# EasyEDA Pro project 交直流分离电路.eprj

# Schematic Schematic1
Board Name: Board1; Create Date: 2025-07-15; Page Name: P1; Project Name: 交直流分离电路; Schematic Name: Schematic1; Update Date: 2025-07-16; Page Size: A4; Version: V1.0
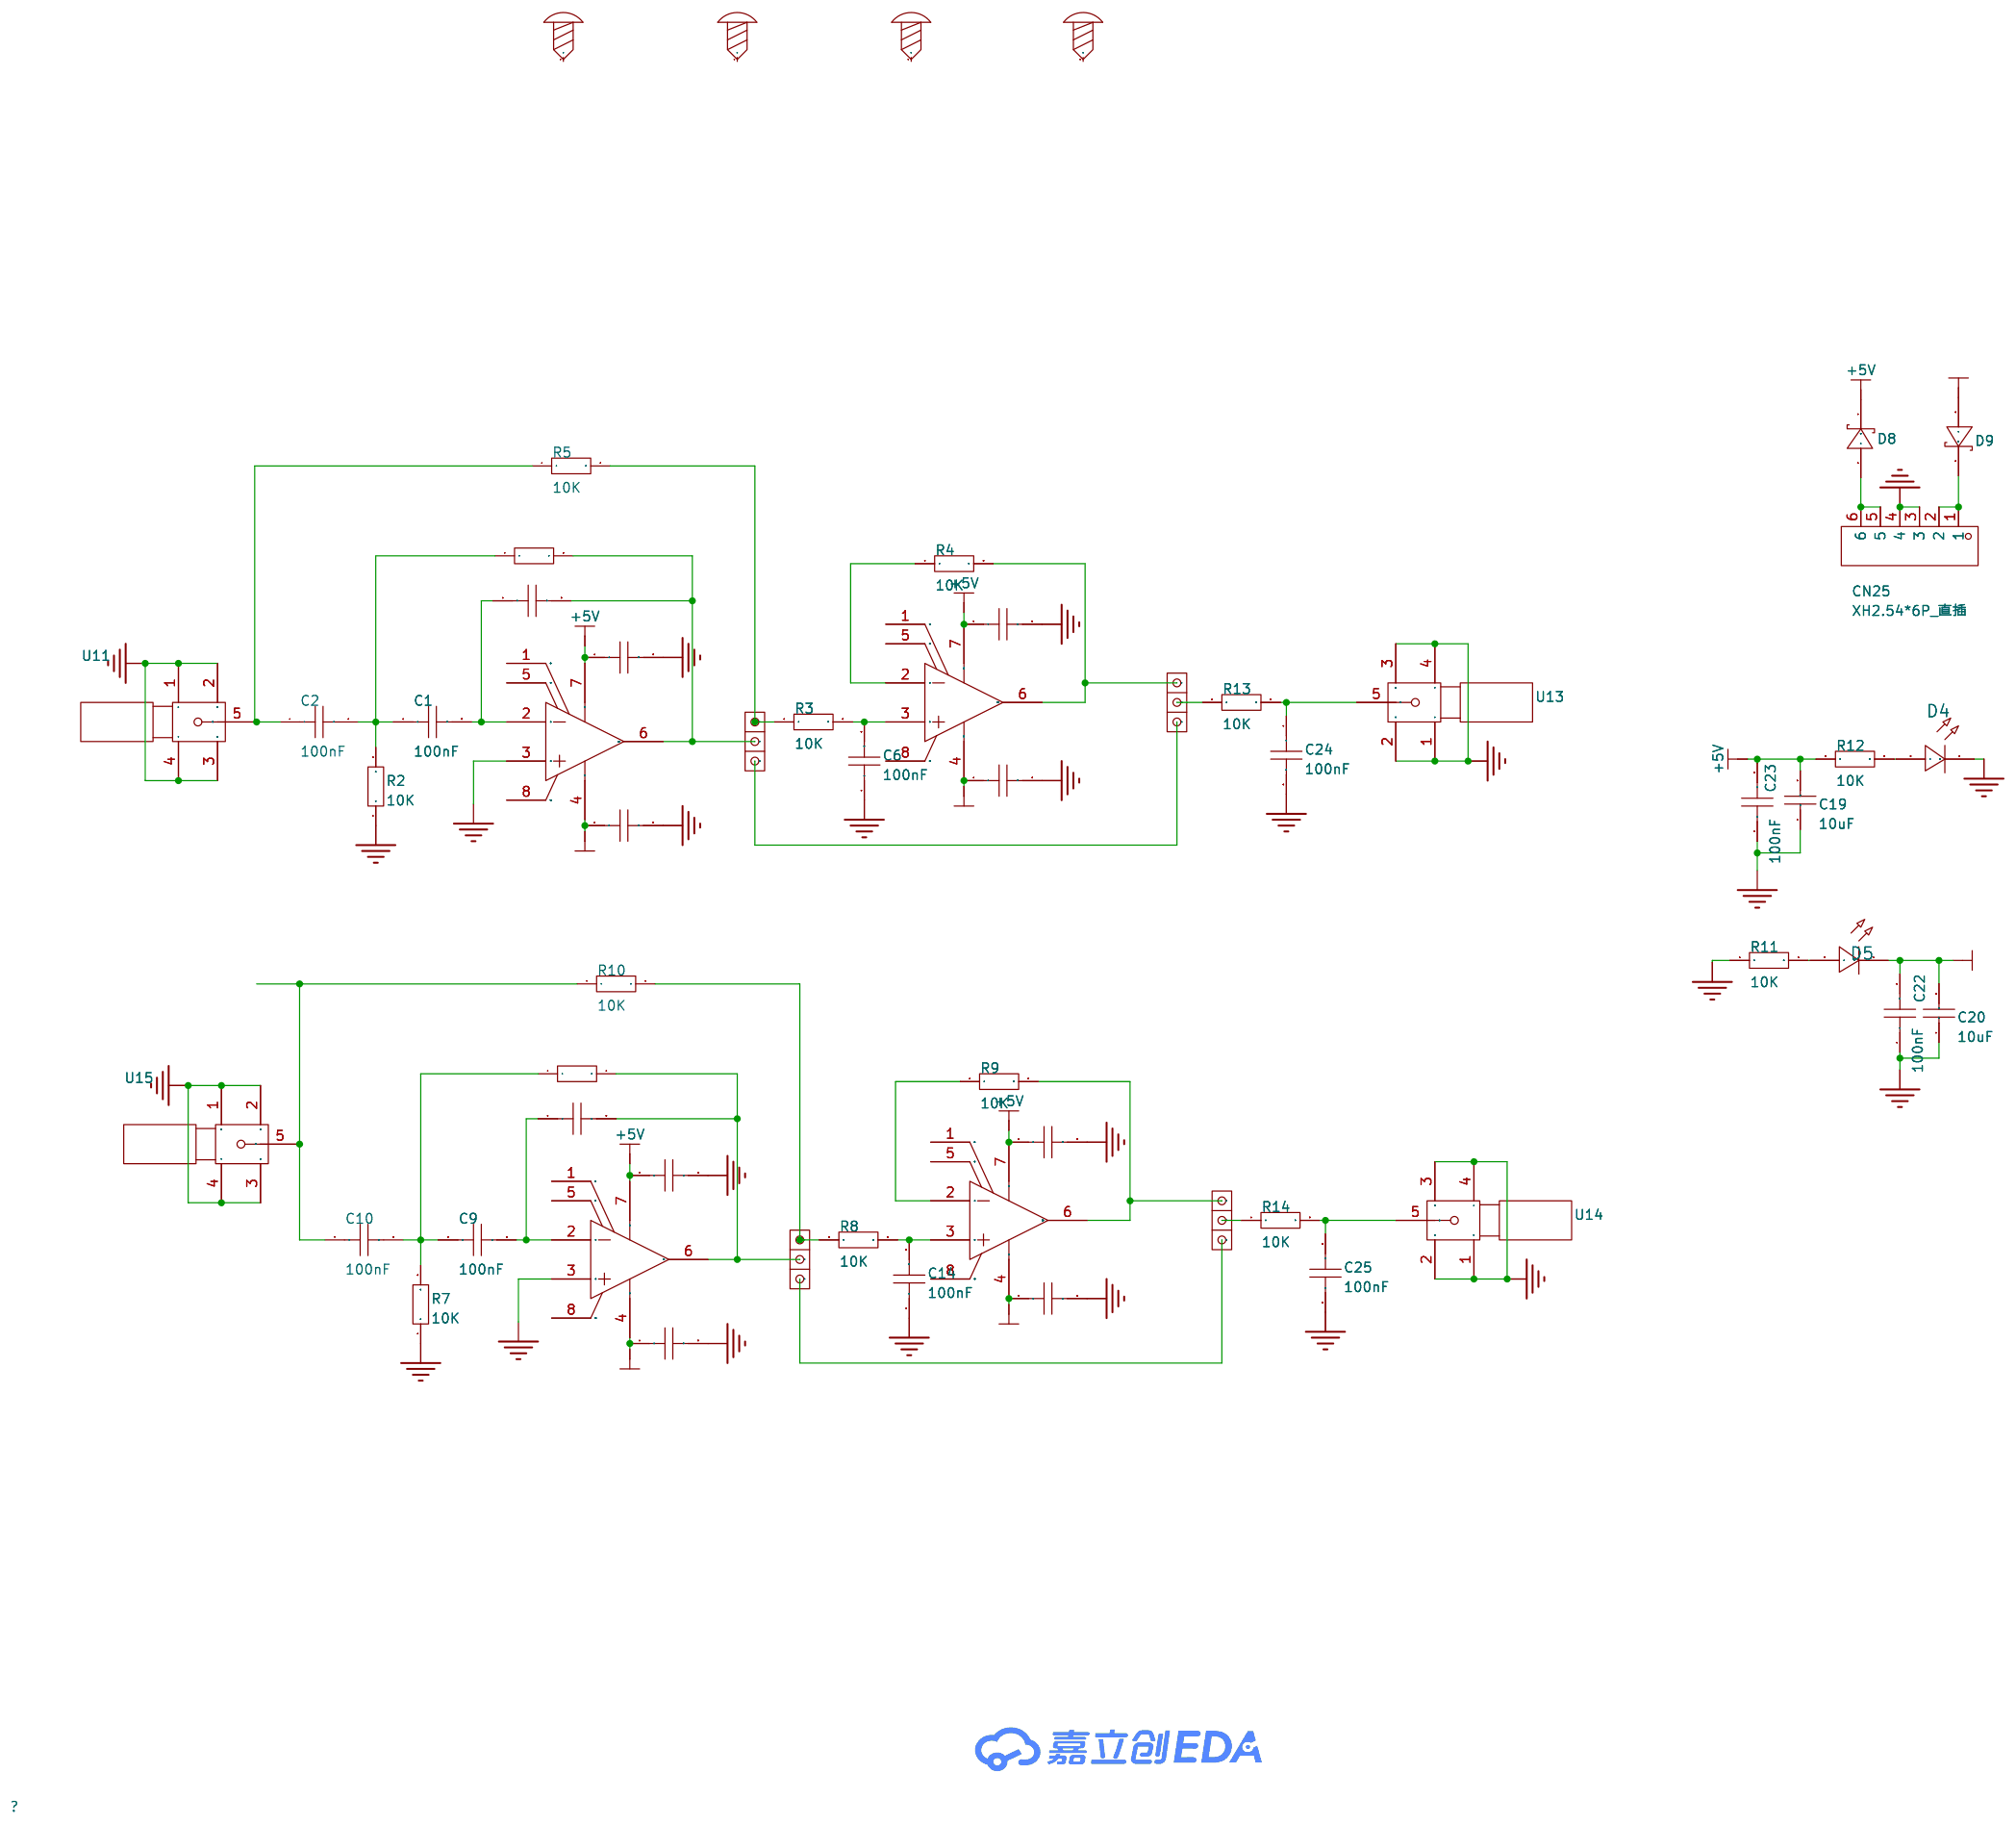
[diagram p0: schematic sheet]

## Parts
C1  100nF  [R0805]
C2  100nF  [R0805]
C3  100nF  [R0805]
C4  100nF  [R0805]
C5  100nF  [R0805]
C6  100nF  [R0805]
C7  100nF  [R0805]
C8  100nF  [R0805]
C9  100nF  [R0805]
C10  100nF  [R0805]
C11  100nF  [R0805]
C12  100nF  [R0805]
C13  100nF  [R0805]
C14  100nF  [R0805]
C15  100nF  [R0805]
C16  100nF  [R0805]
C19  10uF  [C1210]
C20  10uF  [C1210]
C22  100nF  [R0805]
C23  100nF  [R0805]
C24  100nF  [R0805]
C25  100nF  [R0805]
CN25  XH2.54*6P_直插  [CONN-TH_XH2.54-6P]
D4  -  [LED_0805]
D5  -  [LED_0805]
D8  SD103AWS  [SOD-323_L1.8-W1.3-LS2.5-RD]
D9  SD103AWS  [SOD-323_L1.8-W1.3-LS2.5-RD]
R1  10K  [R0805]
R2  10K  [R0805]
R3  10K  [R0805]
R4  10K  [R0805]
R5  10K  [R0805]
R6  10K  [R0805]
R7  10K  [R0805]
R8  10K  [R0805]
R9  10K  [R0805]
R10  10K  [R0805]
R11  10K  [R0805]
R12  10K  [R0805]
R13  10K  [R0805]
R14  10K  [R0805]
SCREW1  -  [M3螺丝]
SCREW2  -  [M3螺丝]
SCREW3  -  [M3螺丝]
SCREW4  -  [M3螺丝]
U1  OPA695IDR  [SOIC-8_L5.0-W4.0-P1.27-LS6.1-BL]
U2  -  [1*3跳线]
U3  OPA695IDR  [SOIC-8_L5.0-W4.0-P1.27-LS6.1-BL]
U4  -  [1*3跳线]
U5  OPA695IDR  [SOIC-8_L5.0-W4.0-P1.27-LS6.1-BL]
U6  -  [1*3跳线]
U7  OPA695IDR  [SOIC-8_L5.0-W4.0-P1.27-LS6.1-BL]
U8  -  [1*3跳线]
U11  -  [SMA]
U13  -  [SMA]
U14  -  [SMA]
U15  -  [SMA]

## Library data of the parts
C1-C16 C22-C25 = CAP_0805: Supplier Footprint: 0805
C19 C20 = CL32B106KAJNNNE: 容值:10uF;精度:±10%;额定电压:25V;材质(温度系数):X7R;; LCSC Part Name: 10uF ±10% 25V; Supplier Part: C39232; Manufacturer: SAMSUNG(三星); Supplier Footprint: 1210; JLCPCB Part Class: 扩展库; Datasheet: https://atta.szlcsc.com/upload/public/pdf/source/20160218/1457707763339.pdf; Supplier: LCSC; Tolerance: ±10%; Voltage Rated: 25V; Temperature Coefficient: X7R
CN25 = XH2.54*6P_直插: Supplier Part: C9900008614; Supplier Footprint: XH2.54_6P; JLCPCB Part Class: 扩展库; Supplier: LCSC
D4 D5 = LED_0805-R: Supplier Footprint: 0805
D8 D9 = SD103AWS_C181207: 正向压降(Vf):600mV@200mA;直流反向耐压(Vr):40V;整流电流:350mA;; LCSC Part Name: 电压:40V 电流:350mA 丝印S4; Supplier Part: C181207; Manufacturer: Hottech(合科泰); Supplier Footprint: SOD-323; JLCPCB Part Class: 扩展库; Datasheet: https://atta.szlcsc.com/upload/public/pdf/source/20240513/4691873FBB9173EFBCF4C6FD4BBA1025.pdf; Supplier: LCSC; Forward Voltage (Vf@If): 600mV@200mA; Reverse Voltage (Vr): 40V; Rectified Current: 350mA
R1-R14 = Res_0805: Supplier Footprint: 0805
SCREW1-SCREW4 = M3螺丝: Supplier Footprint: 插件
U1 U3 U5 U7 = OPA695IDR: Supplier Part: C1848175; Manufacturer: TI(德州仪器); Supplier Footprint: SOIC-8; JLCPCB Part Class: 扩展库; Datasheet: https://www.ti.com/cn/lit/gpn/opa695; Supplier: LCSC; Number of Channels: 单路; Slew Rate: 4.3V/ns; Ib - Input Bias Current: 20uA; Output Current: 120mA; Operating Temperature: -40℃~+85℃
U2 U4 U6 U8 = 1*3跳线
U11 U13-U15 = SMA

## Nets
+5V: C4.1 C7.1 C12.1 C15.1 C19.2 C23.2 D8.1(C) R12.1 U1.7(+VS) U3.7(+VS) U5.7(+VS) U7.7(+VS)
-5V: C5.1 C8.1 C13.1 C16.1 C20.2 C22.2 D5.1(C) D9.2(A) U1.4(-VS) U3.4(-VS) U5.4(-VS) U7.4(-VS)
GND: C4.2 C5.2 C6.1 C7.2 C8.2 C12.2 C13.2 C14.1 C15.2 C16.2 C19.1 C20.1 C22.1 C23.1 C24.2 C25.2 CN25.3 CN25.4 D4.1(C) R2.1 R7.1 R11.1 U1.3(+IN) U5.3(+IN) U11.1 U11.2 U11.3 U11.4 U13.1 U13.2 U13.3 U13.4 U14.1 U14.2 U14.3 U14.4 U15.1 U15.2 U15.3 U15.4
$1N341: C1.2 C3.1 U1.2(-IN)
$1N345: C1.1 C2.2 R1.1 R2.2
$1N358: C3.2 R1.2 U1.6(Output) U2.2
$1N838: R3.1 R5.2 U2.1
$1N842: C6.2 R3.2 U3.3(+IN)
$1N870: R4.1 U3.2(-IN)
$1N879: R4.2 U3.6(Output) U4.1
$1N1220: U2.3 U4.3
$1N1853: C9.1 C10.2 R6.1 R7.2
$1N1859: C9.2 C11.1 U5.2(-IN)
$1N1873: C14.2 R8.2 U7.3(+IN)
$1N1876: R8.1 R10.2 U6.1
$1N1882: R9.1 U7.2(-IN)
$1N1888: C11.2 R6.2 U5.6(Output) U6.2
$1N1897: U6.3 U8.3
$1N1908: R9.2 U7.6(Output) U8.1
$1N2072: CN25.5 CN25.6 D8.2(A)
$1N2074: CN25.1 CN25.2 D9.1(C)
$1N2372: D5.2(A) R11.2
$1N2374: D4.2(A) R12.2
$1N2575: R13.1 U4.2
$1N2579: C24.1 R13.2 U13.5
$1N2780: C25.1 R14.2 U14.5
$1N2788: R14.1 U8.2
$1N3941: C10.1 R10.1 U15.5
$1N3947: C2.1 R5.1 U11.5

Not connected (* = marked no-connect by the designer): SCREW1 1; SCREW2 1; SCREW3 1; SCREW4 1; U1 1(NC) 5(NC) 8(DIS#); U3 1(NC) 5(NC) 8(DIS#); U5 1(NC) 5(NC) 8(DIS#); U7 1(NC) 5(NC) 8(DIS#)

# Board PCB1
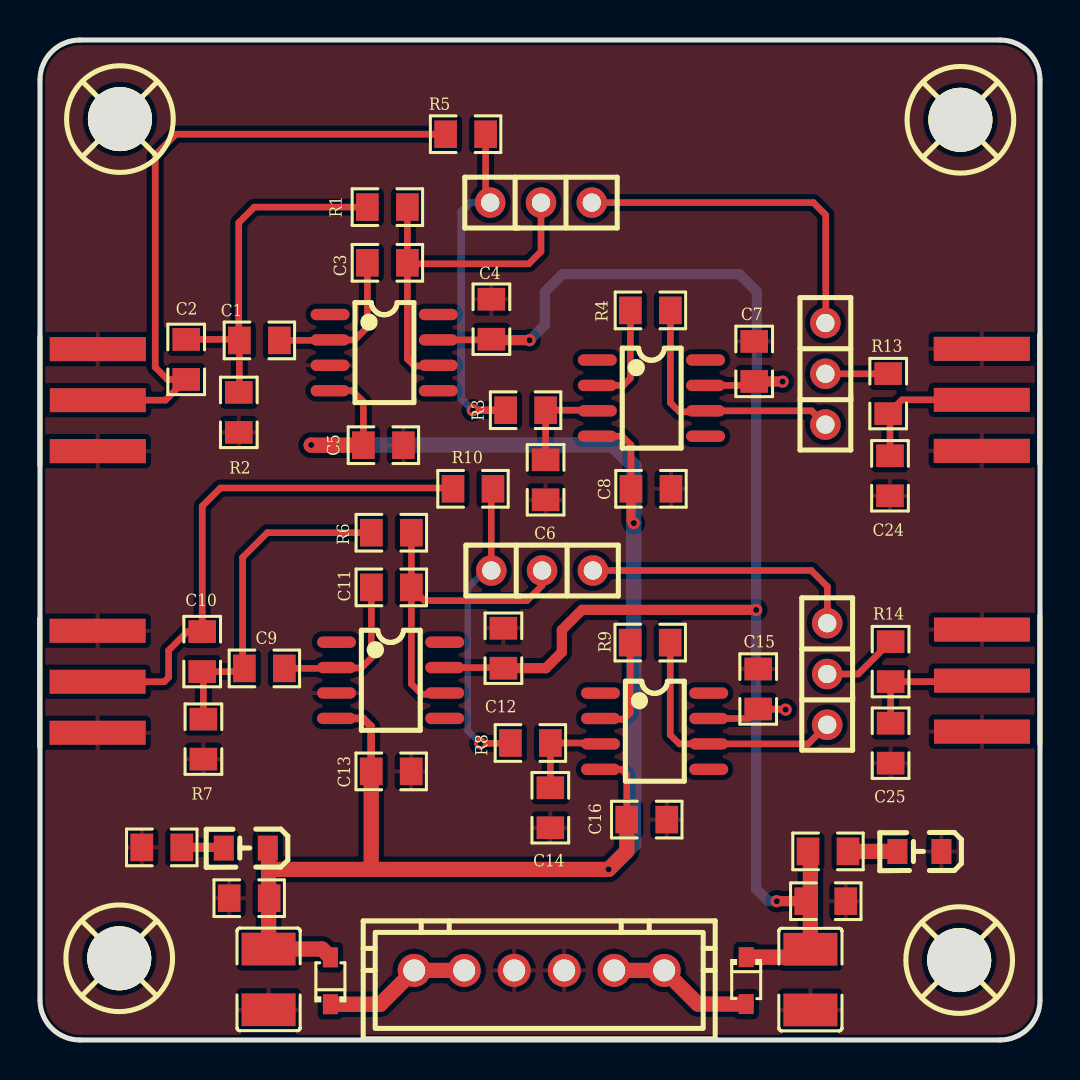
[diagram p1: board, top side]
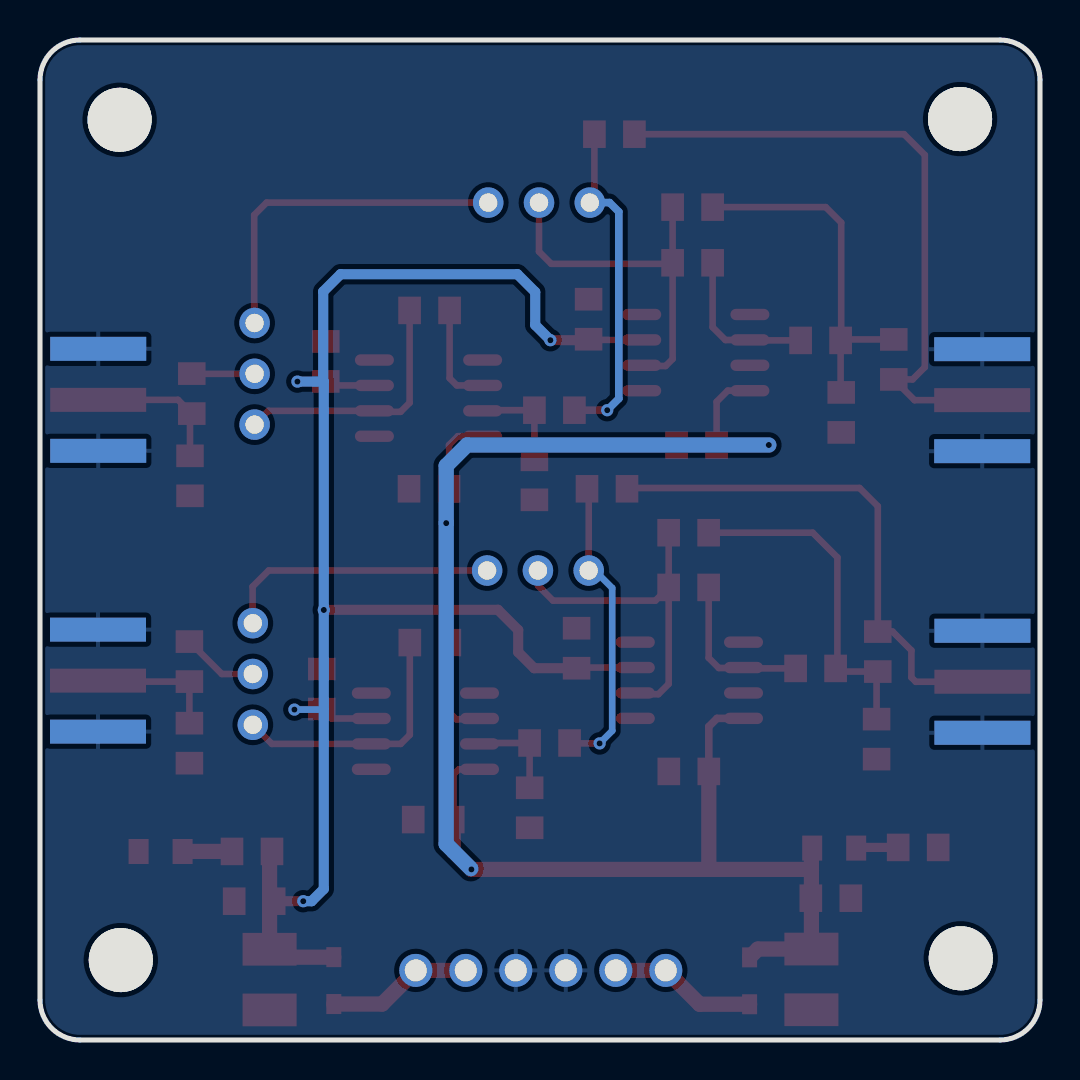
[diagram p2: board, bottom side, seen from below]

Outline 50 x 50 mm; copper layers: Top Layer, Bottom Layer. Coordinates in mm from the lower left corner of the outline.
Outline path: 0,48 0,2 arc(0.59,0.59) 2,0 48,0 arc(49.41,0.59) 50,2 50,48 arc(49.41,49.41) 48,50 2,50 arc(0.59,49.41) 0,48
Stack: Top Layer 0.035mm / Dielectric1 1.51mm FR4 er 4.5 / Bottom Layer 0.035mm

## Design rules (mm)
template: 自定义配置
spacing copperThickness1oz (default): track to track 0.102, other pairs 0.152 to 0.3
spacing copperThickness2oz: track to track 0.203, other pairs 0.152 to 0.3
track width copperThickness1oz (default): min 0.127, default 0.33, max 2.54
track width copperThickness2oz: min 0.203, default 0.254, max 2.54
differential pair differentialPair (default): width min 0.127, default 0.254, max 2.54; gap min 0.152, default 0.152
via viaSize (default): diameter min 0.5, default 0.61, max 10; hole min 0.3, default 0.305, max 6.3

## Placement (name value [footprint] x y rotation side)
C1  100nF  [R0805]  11.08 34.98 0 top
C2  100nF  [R0805]  7.31 34.14 90 top
C3  100nF  [R0805]  17.48 38.86 0 top
C4  100nF  [R0805]  22.57 36.15 90 top
C5  100nF  [R0805]  17.28 29.74 0 top
C6  100nF  [R0805]  25.28 28.12 90 top
C7  100nF  [R0805]  35.71 34.04 90 top
C8  100nF  [R0805]  30.66 27.56 0 top
C9  100nF  [R0805]  11.33 18.58 0 top
C10  100nF  [R0805]  8.11 19.31 270 top
C11  100nF  [R0805]  17.68 22.63 0 top
C12  100nF  [R0805]  23.17 19.7 90 top
C13  100nF  [R0805]  17.67 13.43 0 top
C14  100nF  [R0805]  25.52 11.72 90 top
C15  100nF  [R0805]  35.91 17.66 90 top
C16  100nF  [R0805]  30.45 11.02 0 top
C19  10uF  [C1210]  38.52 3.02 90 top
C20  10uF  [C1210]  11.43 3.03 90 top
C22  100nF  [R0805]  10.57 7.09 0 top
C23  100nF  [R0805]  39.18 6.94 180 top
C24  100nF  [R0805]  42.5 28.1 270 top
C25  100nF  [R0805]  42.53 14.73 270 top
CN25  XH2.54*6P_直插  [CONN-TH_XH2.54-6P]  24.96 3.48 0 top
D4  -  [LED_0805]  43.92 9.43 180 top
D5  -  [LED_0805]  10.24 9.6 180 top
D8  SD103AWS  [SOD-323_L1.8-W1.3-LS2.5-RD]  35.31 2.97 270 top
D9  SD103AWS  [SOD-323_L1.8-W1.3-LS2.5-RD]  14.52 2.96 90 top
R1  10K  [R0805#2]  17.37 41.64 0 top
R2  10K  [R0805#2]  9.94 31.38 90 top
R3  10K  [R0805#2]  24.28 31.49 0 top
R4  10K  [R0805#2]  30.52 36.48 0 top
R5  10K  [R0805#2]  21.28 45.29 0 top
R6  10K  [R0805#2]  17.57 25.36 0 top
R7  10K  [R0805#2]  8.17 15.04 90 top
R8  10K  [R0805#2]  24.52 14.85 0 top
R9  10K  [R0805#2]  30.51 19.87 0 top
R10  10K  [R0805#2]  21.65 27.56 0 top
R11  10K  [R0805#2]  6.09 9.63 0 top
R12  10K  [R0805#2]  39.4 9.43 0 top
R13  10K  [R0805#2]  42.41 32.32 270 top
R14  10K  [R0805#2]  42.53 18.92 270 top
SCREW1  -  [M3螺丝]  4 46.05 0 top
SCREW2  -  [M3螺丝]  46.02 46.01 0 top
SCREW3  -  [M3螺丝]  3.96 4.09 0 top
SCREW4  -  [M3螺丝]  45.96 4 0 top
U1  OPA695IDR  [SOIC-8_L5.0-W4.0-P1.27-LS6.1-BL]  17.21 34.37 270 top
U2  -  [1*3跳线]  27.59 41.87 90 top
U3  OPA695IDR  [SOIC-8_L5.0-W4.0-P1.27-LS6.1-BL]  30.57 32.09 270 top
U4  -  [1*3跳线]  39.27 35.85 180 top
U5  OPA695IDR  [SOIC-8_L5.0-W4.0-P1.27-LS6.1-BL]  17.53 17.99 270 top
U6  -  [1*3跳线]  27.64 23.47 90 top
U7  OPA695IDR  [SOIC-8_L5.0-W4.0-P1.27-LS6.1-BL]  30.73 15.44 270 top
U8  -  [1*3跳线]  39.36 20.84 180 top
U11  -  [SMA]  -0.92 26.13 0 top
U13  -  [SMA]  50.9 37.87 180 top
U14  -  [SMA]  50.91 23.83 180 top
U15  -  [SMA]  -0.93 12.05 0 top

## Footprints (pads in the part's own frame, mm; a bottom-side part is the same pattern mirrored in y, then rotated)
1*3跳线
  round 1.524 hole 0.914: 1(0,5.08) 2(0,2.54) 3(0,0)
C1210
  rect 1.635x2.7 smd: 1(-1.518,0) 2(1.518,0)
CONN-TH_XH2.54-6P
  round 1.65 hole 1.1: 1(-6.25,0) 2(-3.75,0) 3(-1.25,0) 4(1.25,0) 5(3.75,0) 6(6.25,0)
LED_0805
  rect 1x1.25 smd: 1(-1.15,0.005) 2(1.05,0.005)
M3螺丝
  round 3.2 hole 3.2: 1(0,0)
R0805
  rect 1.133x1.377 smd: 1(-1.111,0) 2(0.889,0)
R0805#2
  rect 1.133x1.377 smd: 1(-1,0) 2(1,0)
SMA
  rect 4.8x1.2 smd: 1(3.81,8.412) 2(3.81,3.312) 5(3.81,5.862)
  rect 4.8x1.2 smd far side: 3(3.81,3.312) 4(3.81,8.412)
SOD-323_L1.8-W1.3-LS2.5-RD
  rect 1x0.75 smd: 1(-1.173,0) 2(1.173,0)
SOIC-8_L5.0-W4.0-P1.27-LS6.1-BL
  oval 0.569x1.95 smd: 1(-1.905,-2.705) 2(-0.635,-2.705) 3(0.635,-2.705) 4(1.905,-2.705) 5(1.905,2.705) 6(0.635,2.705) 7(-0.635,2.705) 8(-1.905,2.705)

## Nets
As in the schematic.

Pads without a net: SCREW1 1; SCREW2 1; SCREW3 1; SCREW4 1; U1 1 5 8; U3 1 5 8; U5 1 5 8; U7 1 5 8

## Via types
v1: diameter 0.61, hole 0.305, Top Layer to Bottom Layer, 10 vias

## Routing (per net, layer and track width the routed paths; a pad name or vN(x,y) marks a point on that pad's centre or on a via; arc(x,y) is an arc through that point)
+5V: length 87.8
  Top Layer w0.33: C12.1 23.14,18.62 20.23,18.62 ; U7.7 35.44,16.08 C15.1 37.25,16.55 v1(37.28,16.52) ; C7.1 35.51,32.73 U3.7 ; 19.91,35 22.54,35 C4.1
  Top Layer w0.508: C4.1 22.62,34.99 v1(24.48,34.99) ; C12.1 25.29,18.59 26.09,19.39 26.09,20.5 27.1,21.51 35.8,21.51 v1(35.81,21.5) ; v1(36.84,6.94) C23.2 ; v1(37.13,32.92) 37.12,32.93 C7.1
  Top Layer w0.762: R12.1 38.52,9.31 C19.2 38.12,4.14 D8.1
  Bottom Layer w0.33: 35.81,16.55 35.84,16.52 v1(37.28,16.52)
  Bottom Layer w0.508: 35.84,32.96 35.84,37.42 34.97,38.29 26.13,38.29 25.24,37.4 25.24,35.75 v1(24.48,34.99) ; 35.84,32.96 35.81,32.93 v1(35.81,21.5) 35.81,7.55 36.42,6.94 v1(36.84,6.94) ; 35.84,32.96 35.88,32.92 v1(37.13,32.92)
-5V: length 90.7
  Top Layer w0.33: C16.1 29.34,13.26 29.06,13.53 U7.4 ; C8.1 29.55,29.75 29.11,30.19 27.87,30.19 ; U1.4 14.51,32.47 15.61,32.47 16.17,31.91 C5.1
  Top Layer w0.381: U5.4 16.15,16.08 16.56,15.67 C13.1
  Top Layer w0.457: v1(29.69,25.84) 29.55,25.98 C8.1
  Top Layer w0.762: 11.43,8.47 11.43,9.56 D5.1 ; 11.43,8.47 C20.2 14.1,4.55 D9.2 ; 11.43,8.47 11.49,8.53 16.5,8.53 ; 16.5,8.53 v1(28.43,8.53) 29.34,9.44 C16.1 ; 16.5,8.53 16.56,8.59 C13.1 ; C5.1 13.57,29.74 v1(13.56,29.75)
  Bottom Layer w0.762: v1(13.56,29.75) 28.65,29.75 29.69,28.71 v1(29.69,25.84) 29.69,9.8 28.46,8.57
$1N341: length 7.9
  Top Layer w0.33: C3.1 16.37,35.64 15.73,35 14.51,35 14.5,35 14.48,34.98 11.97,34.98
$1N345: length 18.2
  Top Layer w0.33: 9.97,34.73 9.97,32.41 R2.2 ; 9.97,34.73 9.97,34.98 ; 9.97,34.73 9.94,34.76 9.94,35.01 ; 9.94,35.01 9.94,40.87 10.71,41.64 R1.1 ; 9.94,35.01 9.92,35.03 C2.2
$1N358: length 18.7
  Top Layer w0.33: U1.6 19.88,33.7 18.72,33.7 18.37,34.05 C3.2 ; U2.2 25.05,39.42 24.44,38.81 18.42,38.81 C3.2 ; C3.2 R1.2
$1N838: length 17
  Top Layer w0.33: R5.2 22.28,42.1 U2.1
  Top Layer w0.381: v1(21.64,31.49) R3.1
  Bottom Layer w0.381: v1(21.64,31.49) 21.06,32.07 21.06,41.41 21.52,41.87 U2.1
$1N842: length 5.1
  Top Layer w0.33: C6.2 R3.2 27.84,31.49 27.87,31.46
$1N870: length 5.2
  Top Layer w0.33: U3.2 29.16,32.73 29.52,33.09 R4.1
$1N879: length 12.9
  Top Layer w0.33: R4.2 31.52,31.86 31.97,31.41 33.23,31.41 33.28,31.46 38.58,31.46 U4.1
$1N1220: length 17.4
  Top Layer w0.33: U2.3 38.67,41.87 39.29,41.25 39.29,35.87 U4.3
$1N1853: length 17.1
  Top Layer w0.33: R7.2 8.17,18.36 C10.2 10.06,18.42 C9.1 10.13,18.67 10.13,24.13 11.36,25.36 R6.1
$1N1859: length 8.1
  Top Layer w0.33: C11.1 16.57,19.11 16.06,18.6 14.8,18.6 14.78,18.58 C9.2
$1N1873: length 4.8
  Top Layer w0.33: C14.2 25.52,12.61 R8.2 27.98,14.85 U7.3
$1N1876: length 15.2
  Top Layer w0.33: R8.1 23.5,14.83 v1(22.02,14.83) ; R10.2 22.56,27.47 U6.1
  Bottom Layer w0.33: v1(22.02,14.83) 21.39,15.46 21.39,22.6 22.26,23.47 U6.1
$1N1882: length 5.1
  Top Layer w0.33: U7.2 28.06,16.04 29.19,16.04 29.51,16.36 R9.1
$1N1888: length 17.3
  Top Layer w0.33: U5.6 20.17,17.29 19.08,17.29 18.57,17.8 C11.2 ; U6.2 25.1,22.72 24.35,21.97 19.23,21.97 C11.2 ; C11.2 R6.2
$1N1897: length 13.9
  Top Layer w0.33: U8.3 39.37,20.85 39.37,22.67 38.57,23.47 U6.3
$1N1908: length 13
  Top Layer w0.33: R9.2 31.51,15.26 31.97,14.81 U7.6 38.41,14.81 U8.1
$1N2072: length 7.3
  Top Layer w0.762: CN25.5 CN25.6 32.89,1.8 D8.2
$1N2074: length 7.4
  Top Layer w0.762: CN25.2 CN25.1 17.02,1.79 D9.1
$1N2372: length 2.1
  Top Layer w0.457: R11.2 9.16,9.63 D5.2
$1N2374: length 2.5
  Top Layer w0.762: R12.2 42.86,9.43 42.87,9.42
$1N2575: length 3.1
  Top Layer w0.33: U4.2 42.4,33.31 R13.1
$1N2579: length 7.1
  Top Layer w0.33: C24.1 42.5,31.23 R13.2 43.1,32.01 U13.5
$1N2780: length 6.7
  Top Layer w0.33: U14.5 47.05,17.92 R14.2 42.53,15.84
$1N2788: length 3.8
  Top Layer w0.33: R14.1 40.91,18.3 U8.2
$1N3941: length 26.3
  Top Layer w0.33: U15.5 6.21,17.91 6.43,18.13 6.43,19.48 7.37,20.42 C10.1 8.11,26.69 9.02,27.6 20.61,27.6 R10.1
$1N3947: length 32.2
  Top Layer w0.33: R5.1 6.8,45.29 5.76,44.25 5.76,33.64 6.37,33.03 C2.1 6.27,31.99 U11.5

## Copper pours and planes (outline as drawn; the poured copper is in the pictures)
GND on Top Layer: -10.88,65.83 60.24,65.83 60.24,-15.45 -10.88,-15.45
GND on Bottom Layer: -10.21,70.12 54.14,70.12 54.14,-17.71 -10.21,-17.71
